# EAGLE design Feather Board Shield (EAGLE 9.0.1)
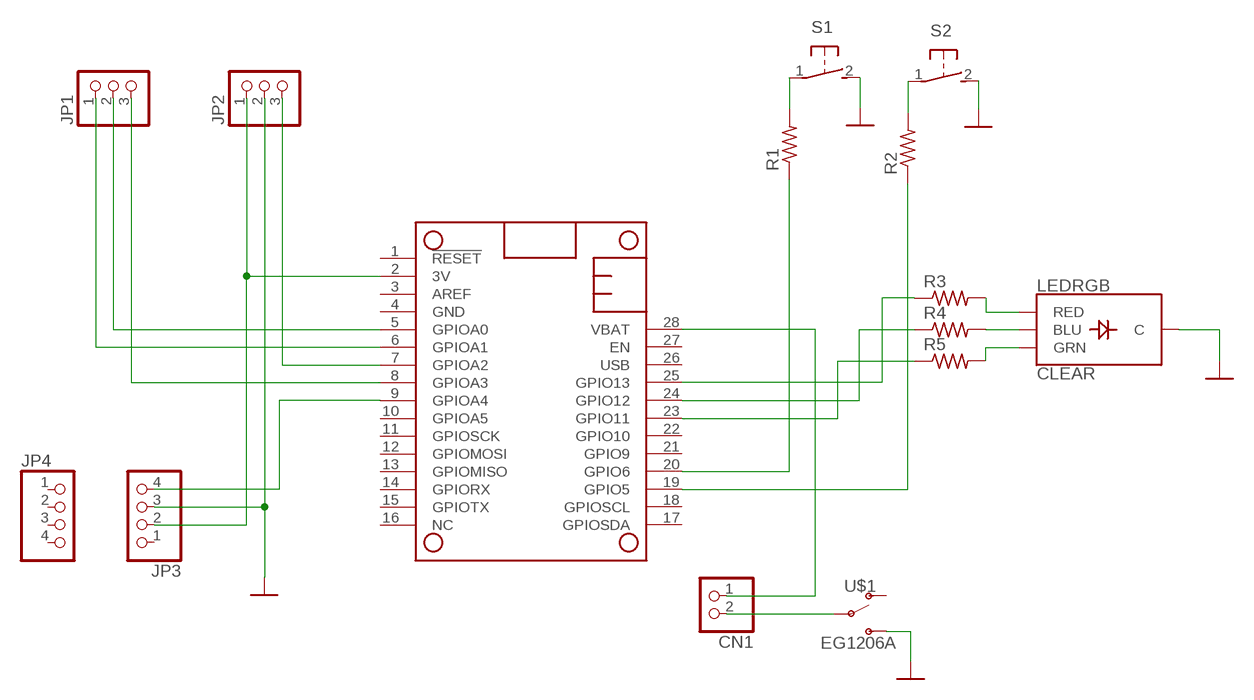
[diagram p0: schematic, sheet 1]

## Parts
CN1  ADAFRUIT_JST_2PIN-SMT-RA  [ADAFRUIT_JST-PH-2-SMT-RA]
JP1  PINHEAD_PINHD-1X3/90  [PINHEAD_1X03/90]
JP2  PINHEAD_PINHD-1X3/90  [PINHEAD_1X03/90]
JP3  PINHEAD_PINHD-1X4  [PINHEAD_1X04]
JP4  PINHEAD_PINHD-1X4  [PINHEAD_1X04]
LEDRGB  CLEAR  SPARKFUN-LED_LED-RGB-CCCLEAR  [SPARKFUN-LED_LED-RGB-THRU]
MS1  ADAFRUIT_FEATHERWING_NODIM  [ADAFRUIT_FEATHERWING_DIM]
R1  RESISTOR_R-US_0204/7  [RESISTOR_0204/7]
R2  RESISTOR_R-US_0204/7  [RESISTOR_0204/7]
R3  RESISTOR_R-US_0204/7  [RESISTOR_0204/7]
R4  RESISTOR_R-US_0204/7  [RESISTOR_0204/7]
R5  RESISTOR_R-US_0204/7  [RESISTOR_0204/7]
S1  ADAFRUIT_31-XXSKINNY  [ADAFRUIT_B3F-31XX-SKINNIER]
S2  ADAFRUIT_31-XXSKINNY  [ADAFRUIT_B3F-31XX-SKINNIER]
U$1  EG1206A  [EG1206A]

## Nets
3V: JP2.1 JP3.2 MS1.2(3V)
GND: JP2.2 JP3.3 LEDRGB.2(C) S1.2(S) S2.2(S) U$1.3(S) ; supply symbol labelled SPARKFUN-POWERSYMBOLS_GND
N$1: MS1.25(GPIO13) R3.1
N$2: MS1.24(GPIO12) R4.1
N$3: MS1.23(GPIO11) R5.1
N$4: LEDRGB.1(RED) R3.2
N$5: LEDRGB.4(BLU) R4.2
N$6: LEDRGB.3(GRN) R5.2
N$7: MS1.20(GPIO6) R1.1
N$8: MS1.19(GPIO5) R2.1
N$9: R1.2 S1.1(P)
N$10: R2.2 S2.1(P)
N$11: CN1.2 U$1.2(P)
N$12: JP2.3 MS1.7(GPIOA2)
N$13: JP1.1 MS1.6(GPIOA1)
N$14: JP1.2 MS1.5(GPIOA0)
N$15: JP1.3 MS1.8(GPIOA3)
N$16: JP3.4 MS1.9(GPIOA4)
VBAT: CN1.1 MS1.28(VBAT)
Unconnected: JP3.1 JP4.1 JP4.2 JP4.3 JP4.4 MS1.1(!RESET) MS1.3(AREF) MS1.10(GPIOA5) MS1.11(GPIOSCK) MS1.12(GPIOMOSI) MS1.13(GPIOMISO) MS1.14(GPIORX) MS1.15(GPIOTX) MS1.16(NC) MS1.17(GPIOSDA) MS1.18(GPIOSCL) MS1.21(GPIO9) MS1.22(GPIO10) MS1.26(USB) MS1.27(EN) U$1.1(O)

## Power pins joined to a net without a drawn wire
GND: MS1.4(GND)

## Library data of the parts
CN1 = MMC Eagle:ADAFRUIT_JST_2PIN: JST 2-Pin Connectors of various flavors SMT-RA (S2B-PH-SM4) 4UConnector #17311 SMT (B2B-PH-SM4) THM-RA (S2B-PH) THM (B2B-PH)
JP1 JP2 = MMC Eagle:PINHEAD_PINHD-1X3: PIN HEADER
JP3 JP4 = MMC Eagle:PINHEAD_PINHD-1X4: PIN HEADER
LEDRGB = MMC Eagle:SPARKFUN-LED_LED-RGB-CC: LED-RGB Common Cathode Packages: LED RGB-THRU LED_PIRANHA_5MM SparkFun Products: RGB Diffused Common Cathode- Diffuse <[https://www.sparkfun.com/products/9264]> RGB Diffused Common Cathode - Clear <[https://www.sparkfun.com/products/105]> LED-RGB 5mm Square (Piranha) <[https://www.sparkfun.com/products/11679]>; PROD_ID: DIO-08418
MS1 = MMC Eagle:ADAFRUIT_FEATHERWING
R1-R5 = MMC Eagle:RESISTOR_R-US_: RESISTOR, American symbol
S1 S2 = MMC Eagle:ADAFRUIT_31-XX: OMRON SWITCH Now with beefier pads!
U$1 = MMC Eagle:EG1206A

## Net classes
0 default: width 0.254 mm, drill 0.254 mm, clearance 0.356 mm

## Board
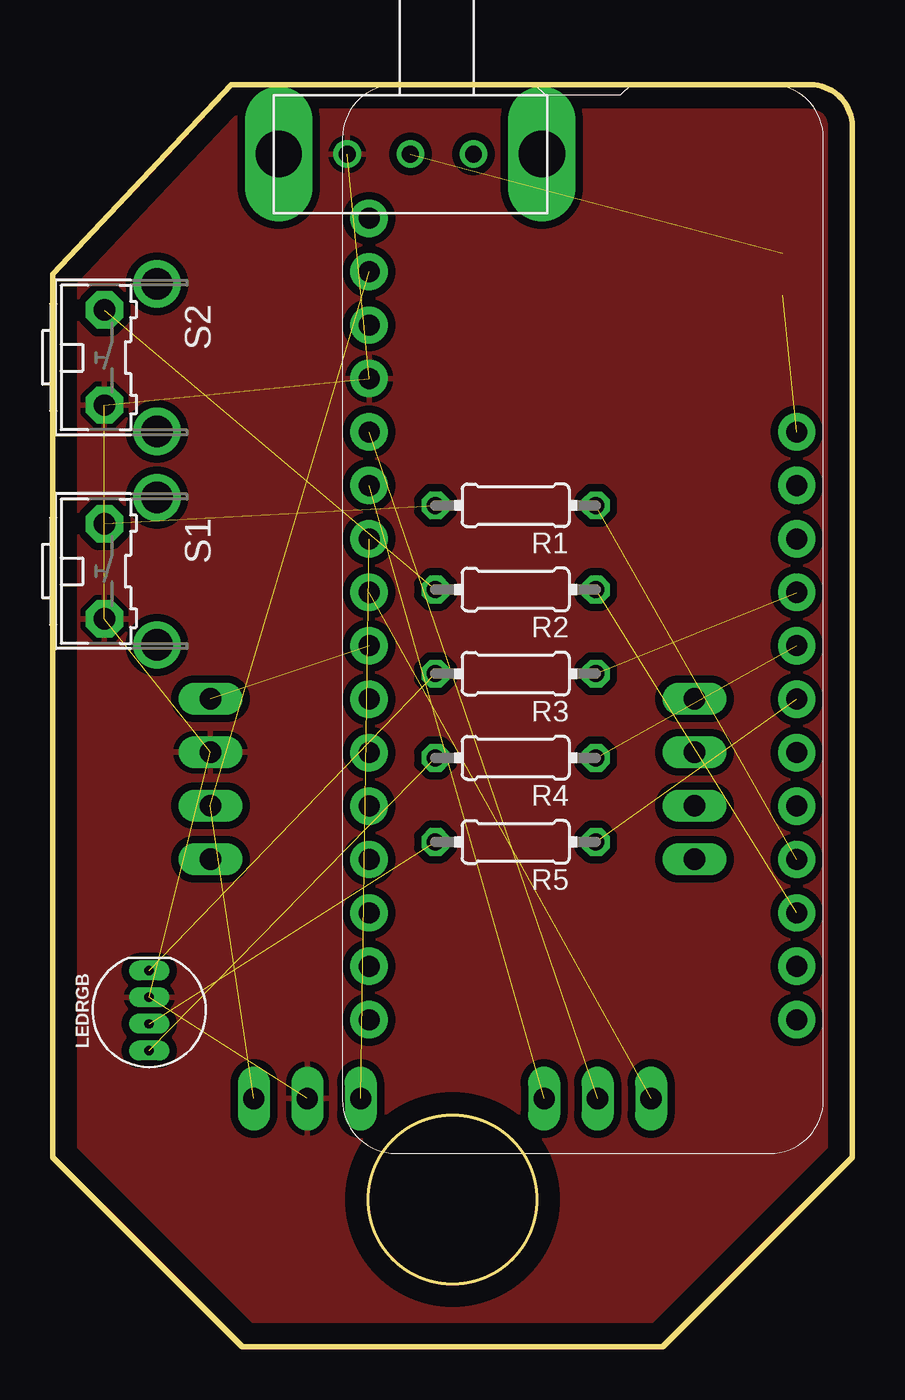
[diagram p1: board, top side]
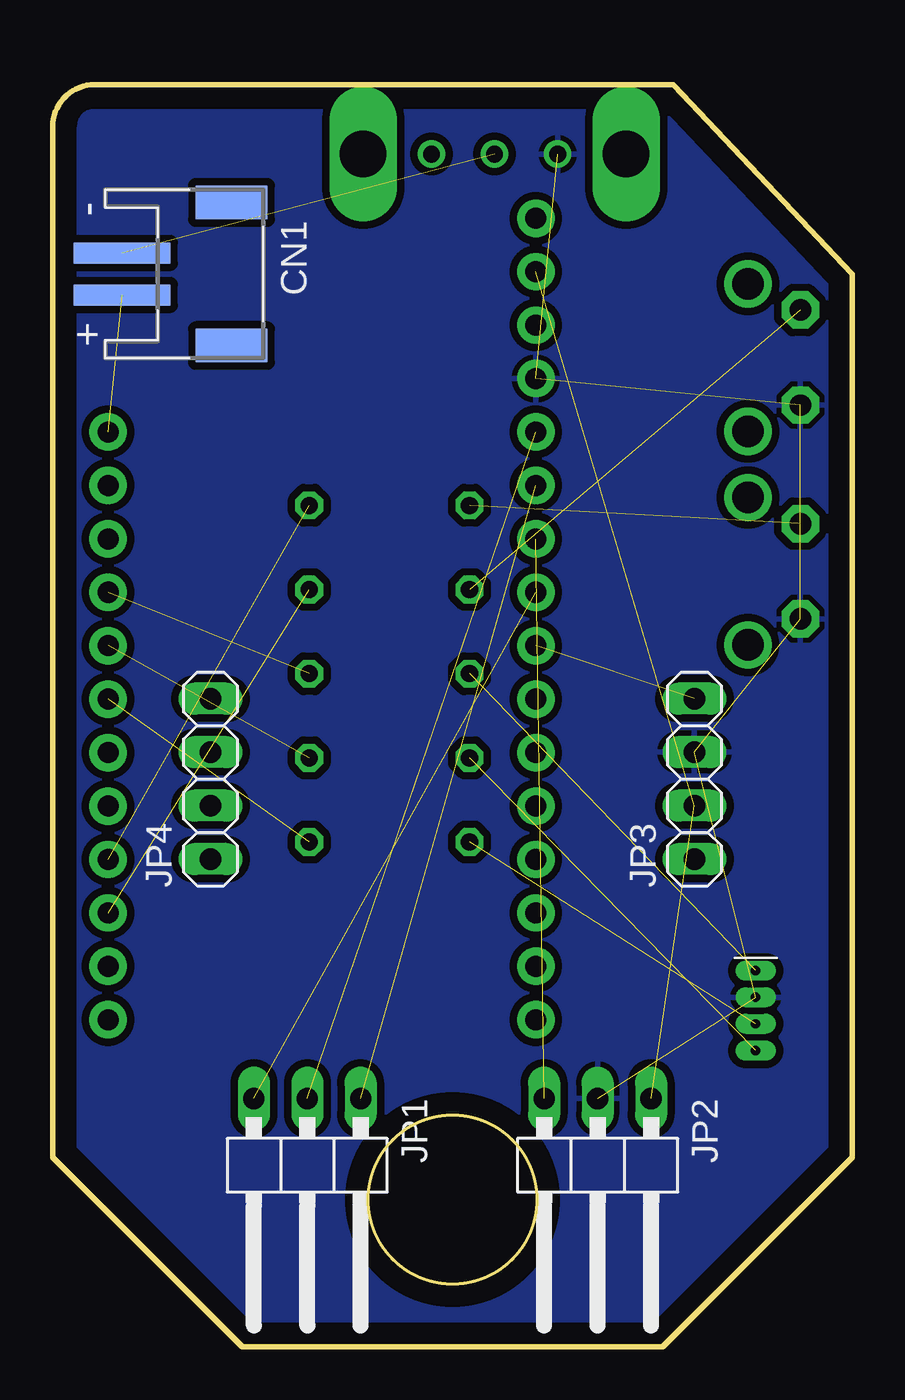
[diagram p2: board, bottom side, seen from below]

Size 38 x 60 mm. Coordinates in mm from the lower left corner, seen from the top.
Outline: 38,9 38,58 arc90 36,60 8.5,60 0,51 0,9 9,0 29,0 38,9
Outline: circle at 19,7 radius 4
Copper layers (1*16): Top 0.035mm / dielectric 0.6mm / Bottom 0.035mm
Design rules "default *": minimum track width 6mil, minimum drill 0.35mm, track to track 6mil, track to pad 6mil, pad to pad 6mil, via to via 6mil, smd to smd 6mil, copper to edge 40mil, drill to drill 6mil, minimum pad ring 10mil, minimum via ring 8mil, stop-mask expansion 4mil, vias tented up to drill 0mil, thermal gap 10mil

### Footprints (pad centres in the part's own frame; a part is rotated, then mirrored left to right if it is on the bottom)
ADAFRUIT_JST-PH-2-SMT-RA = smd 1 x 4.6: 1 1,-3.7; 2 -1,-3.7 | smd 1.6 x 3.4: NC1 -3.4,1.5; NC2 3.4,1.5
PINHEAD_1X03/90 = drill 1.016 long: 1 -2.54,-3.81; 2 0,-3.81; 3 2.54,-3.81
PINHEAD_1X04 = drill 1.016 long: 1 -3.81,0; 2 -1.27,0; 3 1.27,0; 4 3.81,0
SPARKFUN-LED_LED-RGB-THRU = drill 0.45 pad 0.305 long: 1 1.905,0; 2 0.635,0; 3 -0.635,0; 4 -1.905,0
ADAFRUIT_FEATHERWING_DIM = drill 1 pad 1.778: 1 6.35,1.27; 2 8.89,1.27; 3 11.43,1.27; 4 13.97,1.27; 5 16.51,1.27; 6 19.05,1.27; 7 21.59,1.27; 8 24.13,1.27; 9 26.67,1.27; 10 29.21,1.27; 11 31.75,1.27; 12 34.29,1.27; 13 36.83,1.27; 14 39.37,1.27; 15 41.91,1.27; 16 44.45,1.27; 17 44.45,21.59; 18 41.91,21.59; 19 39.37,21.59; 20 36.83,21.59; 21 34.29,21.59; 22 31.75,21.59; 23 29.21,21.59; 24 26.67,21.59; 25 24.13,21.59; 26 21.59,21.59; 27 19.05,21.59; 28 16.51,21.59
RESISTOR_0204/7 = drill 0.813 octagon: 1 -3.81,0; 2 3.81,0
ADAFRUIT_B3F-31XX-SKINNIER = drill 1.016 pad 1.778 octagon: 1 -2.261,-1.245; 2 2.261,-1.245 | drill 1.499 pad 2.032: 3 -3.505,1.245; 4 3.505,1.245
EG1206A = drill 0.8: 1 3.5,2.8; 2 6.5,2.8; 3 9.5,2.8 | drill 2.2 pad 2.54 long: MT1 0.25,2.8; MT2 12.75,2.8

### Placement (x,y rotation side)
CN1  31,51 270 bottom
JP1  25.9,8 180 bottom
JP2  12.1,8 180 bottom
JP3  7.5,27 90 bottom
JP4  30.5,27 90 bottom
LEDRGB  4.59,15.99 90 top
MS1  13.77,60 270 top
R1  22,40 180 top
R2  22,36 180 top
R3  22,32 180 top
R4  22,28 180 top
R5  22,24 180 top
S1  3.71,36.87 270 top
S2  3.71,47.03 270 top
U$1  23.5,59.5 180 top

### Tracks (layer width: path | path; a pad name or v marks a point on that pad's centre or on a via)
3V  (2 unrouted)
GND  (6 unrouted)
  pour Top: 0,6 6,0 32,0 38,6 38,60 6,60 0,54.5
  pour Bottom: 0,7 7,0 32,0 38,6 38,61 6.5,61.5 0,55.5
N$1  (1 unrouted)
N$2  (1 unrouted)
N$3  (1 unrouted)
N$4  (1 unrouted)
N$5  (1 unrouted)
N$6  (1 unrouted)
N$7  (1 unrouted)
N$8  (1 unrouted)
N$9  (1 unrouted)
N$10  (1 unrouted)
N$11  (1 unrouted)
N$12  (1 unrouted)
N$13  (1 unrouted)
N$14  (1 unrouted)
N$15  (1 unrouted)
N$16  (1 unrouted)
VBAT  (1 unrouted)